# EAGLE design 24dc_cup_wash_sucction (EAGLE 8.5.1)

## Sheet 1 of 3
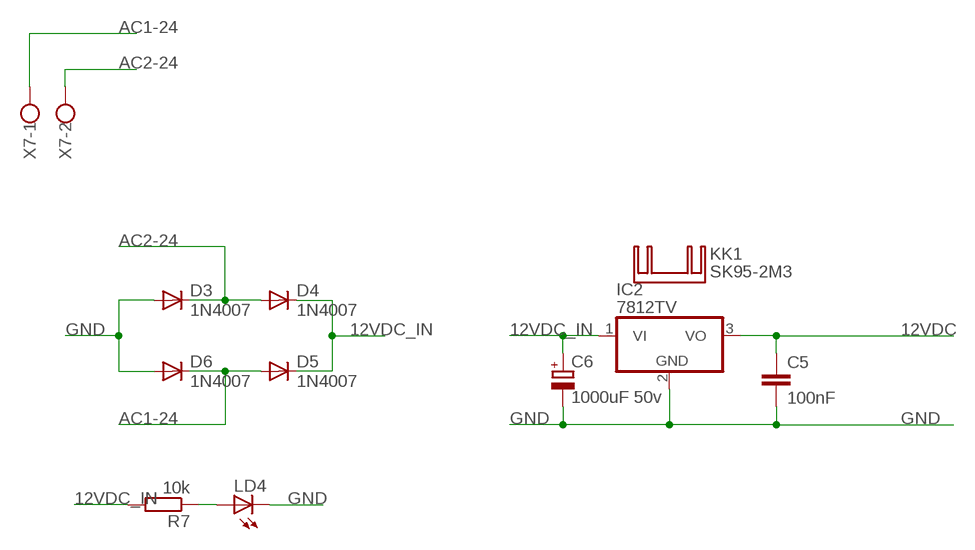
[diagram p0: schematic, sheet 1]

### Parts
C5  100nF  C-EU050-025X075  [C050-025X075]
C6  1000uF 50v  CPOL-EUE5-13  [E5-13]
D3  1N4007  1N4004  [DO41-10]
D4  1N4007  1N4004  [DO41-10]
D5  1N4007  1N4004  [DO41-10]
D6  1N4007  1N4004  [DO41-10]
IC2  7812TV  [TO220V]
KK1  SK95-2M3  [SK95-2M3]
LD4  LED5MM  [LED5MM]
R7  10k  R-EU_0207/10  [0207/10]
X7  W237-102  [W237-102]

### Nets
12VDC: C5.1 IC2.3(VO) ; also sheet 2
12VDC_IN: C6.+ D4.C D5.C IC2.1(VI) R7.2 ; also sheet 2,3
AC1-24: D5.A D6.C X7.1
AC2-24: D3.C D4.A X7.2
GND: C5.2 C6.- D3.A D6.A IC2.2(GND) LD4.K(C) ; also sheet 2,3
N$8: LD4.A R7.1

## Sheet 2 of 3
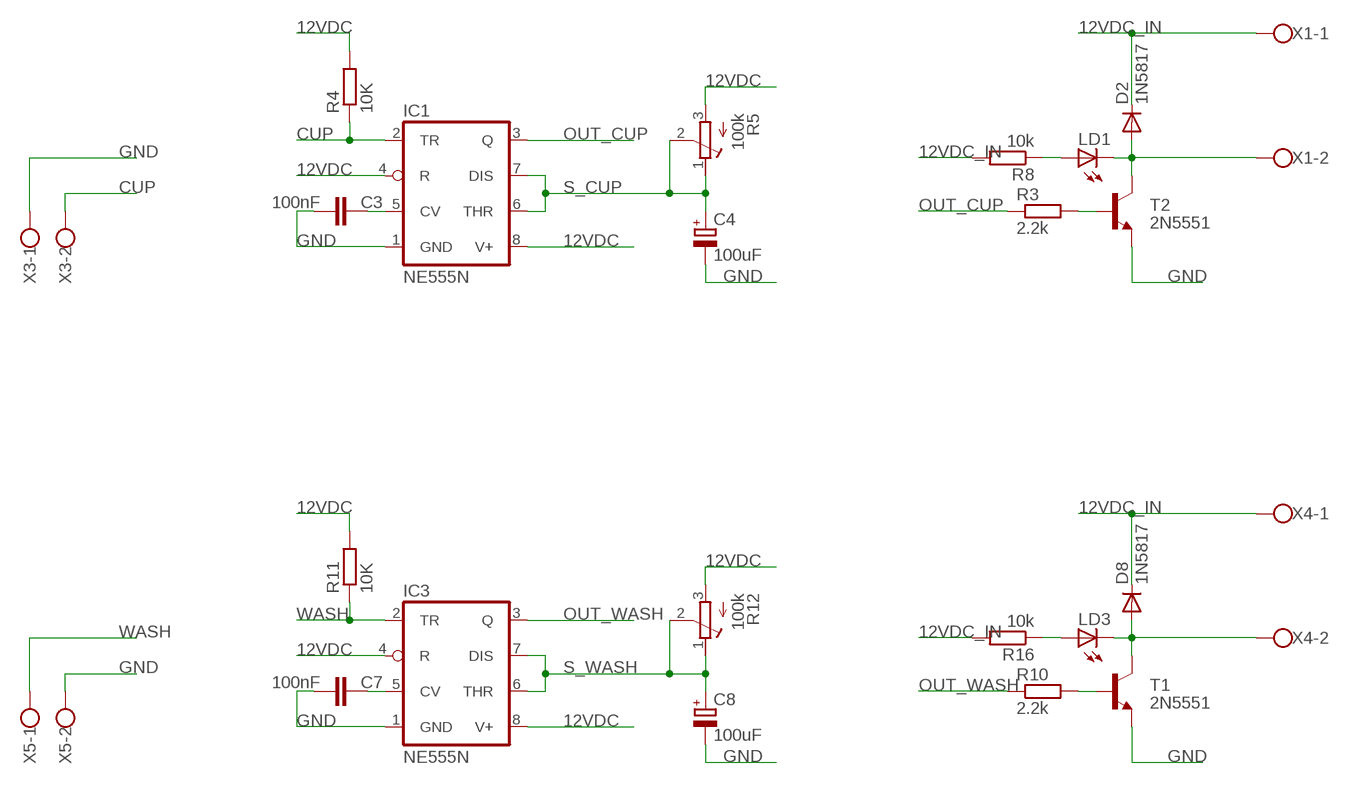
[diagram p1: schematic, sheet 2]

### Parts
C3  100nF  C-EU050-025X075  [C050-025X075]
C4  100uF  CPOL-EUE3.5-8  [E3,5-8]
C7  100nF  C-EU050-025X075  [C050-025X075]
C8  100uF  CPOL-EUE3.5-8  [E3,5-8]
D2  1N5817  1N4004  [DO41-10]
D8  1N5817  1N4004  [DO41-10]
IC1  NE555N  [DIL08-ROUND]
IC3  NE555N  [DIL08-ROUND]
LD1  LED5MM  [LED5MM]
LD3  LED5MM  [LED5MM]
R3  2.2k  R-EU_0207/10  [0207/10]
R4  10K  R-EU_0207/10  [0207/10]
R5  100k  R-TRIMMT93XA  [RTRIMT93XA]
R8  10k  R-EU_0207/10  [0207/10]
R10  2.2k  R-EU_0207/10  [0207/10]
R11  10K  R-EU_0207/10  [0207/10]
R12  100k  R-TRIMMT93XA  [RTRIMT93XA]
R16  10k  R-EU_0207/10  [0207/10]
T1  2N5551  2N2222  [TO92-EBC-OVAL]
T2  2N5551  2N2222  [TO92-EBC-OVAL]
X1  W237-102  [W237-102]
X3  W237-102  [W237-102]
X4  W237-102  [W237-102]
X5  W237-102  [W237-102]

### Nets
12VDC: IC1.4(R) IC1.8(V+) IC3.4(R) IC3.8(V+) R4.2 R5.3(A) R11.2 R12.3(A) ; also sheet 1
12VDC_IN: D2.C D8.C R8.2 R16.2 X1.1 X4.1 ; also sheet 1,3
CUP: IC1.2(TR) R4.1 X3.2
GND: C3.2 C4.- C7.2 C8.- IC1.1(GND) IC3.1(GND) T1.E T2.E X3.1 X5.2 ; also sheet 1,3
N$1: R3.2 T2.B
N$2: C3.1 IC1.5(CV)
N$3: D2.A LD1.K(C) T2.C X1.2
N$5: C7.1 IC3.5(CV)
N$6: LD1.A R8.1
N$11: D8.A LD3.K(C) T1.C X4.2
N$12: R10.2 T1.B
N$14: LD3.A R16.1
OUT_CUP: IC1.3(Q) R3.1
OUT_WASH: IC3.3(Q) R10.1
S_CUP: C4.+ IC1.6(THR) IC1.7(DIS) R5.1(E) R5.2(S)
S_WASH: C8.+ IC3.6(THR) IC3.7(DIS) R12.1(E) R12.2(S)
WASH: IC3.2(TR) R11.1 X5.1

## Sheet 3 of 3
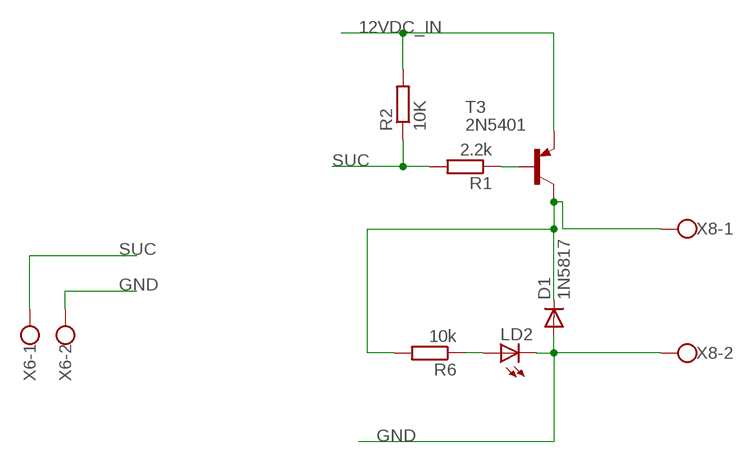
[diagram p2: schematic, sheet 3]

### Parts
D1  1N5817  1N4004  [DO41-10]
LD2  LED5MM  [LED5MM]
R1  2.2k  R-EU_0207/10  [0207/10]
R2  10K  R-EU_0207/10  [0207/10]
R6  10k  R-EU_0207/10  [0207/10]
T3  2N5401  2N5401-PNP-TO92-EBC  [TO92-EBC]
X6  W237-102  [W237-102]
X8  W237-102  [W237-102]

### Nets
12VDC_IN: R2.2 T3.E ; also sheet 1,2
GND: D1.A LD2.K(C) X6.2 X8.2 ; also sheet 1,2
N$7: R1.1 T3.B
N$9: LD2.A R6.1
NS1: D1.C R6.2 T3.C X8.1
SUC: R1.2 R2.1 X6.1

## Library data of the parts
C3 C5 C7 = rcl:C-EU: CAPACITOR, European symbol; SPICEPREFIX: C
C4 C6 C8 = rcl:CPOL-EU: POLARIZED CAPACITOR, European symbol; SPICEPREFIX: C
D1-D6 D8 = adafruit:1N4004: DIODE General purpose 1N400x type rectifier (With bigger pads) http://www.ladyada.net/library/pcb/eaglelibrary.html
IC1 IC3 = adafruit:*555: TIMER Changed DIP package to have round (not oval) pin pads http://www.ladyada.net/library/pcb/eaglelibrary.html
IC2 = linear:78*: Positive VOLTAGE REGULATOR Source: http://cache.national.com/ds/LM/LM78L05.pdf http://www.fairchildsemi.com/ds/LM/LM7805.pdf
KK1 = heatsink:SK95-2M3: HEATSINK manufacturer Fischer/distributor Buerklin
LD1-LD4 = led:LED: LED OSRAM: - CHIPLED LG R971, LG N971, LY N971, LG Q971, LY Q971, LO R971, LY R971 LH N974, LH R974 LS Q976, LO Q976, LY Q976 LO Q996 - Hyper CHIPLED LW Q18S LB Q993, LB Q99A, LB R99A - SideLED LS A670, LO A670, LY A670, LG A670, LP A670 LB A673, LV A673, LT A673, LW A673 LH A674 LY A675 LS A676, LA A676, LO A676, LY A676, LW A676 LS A679, LY A679, LG A679 - Hyper Micro SIDELED® LS Y876, LA Y876, LO Y876, LY Y876 LT Y87S - SmartLED LW L88C, LW L88S LB L89C, LB L89S, LG L890 LS L89K, LO L89K, LY L89K LS L896, LA L896, LO L896, LY L896 - TOPLED LS T670, LO T670, LY T670, LG T670, LP T670 LSG T670, LSP T670, LSY T670, LOP T670, LYG T670 LG T671, LOG T671, LSG T671 LB T673, LV T673, LT T673, LW T673 LH T674 LS T676, LA T676, LO T676, LY T676, LB T676, LH T676, LSB T676, LW T676 LB T67C, LV T67C, LT T67C, LS T67K, LO T67K, LY T67K, LW E67C LS E67B, LA E67B, LO E67B, LY E67B, LB E67C, LV E67C, LT E67C LW T67C LS T679, LY T679, LG T679 LS T770, LO T770, LY T770, LG T770, LP T770 LB T773, LV T773, LT T773, LW T773 LH T774 LS E675, LA E675, LY E675, LS T675 LS T776, LA T776, LO T776, LY T776, LB T776 LHGB T686 LT T68C, LB T68C - Hyper Mini TOPLED® LB M676 - Mini TOPLED Santana® LG M470 LS M47K, LO M47K, LY M47K Source: http://www.osram.convergy.de/
R1-R4 R6-R8 R10 R11 R16 = rcl-2:R-EU_: RESISTOR, European symbol
R5 R12 = rcl:R-TRIMM: Trimm resistor; SPICEMODEL: X; SPICEPREFIXL: POT
T1 T2 = adafruit:2N2222: NPN TRANSISTOR Big oval pads
T3 = transistor-neu-to92:*-PNP-: PNP Transistror
X1 X3-X8 = con-wago-500:W237-102: WAGO SCREW CLAMP

## Board
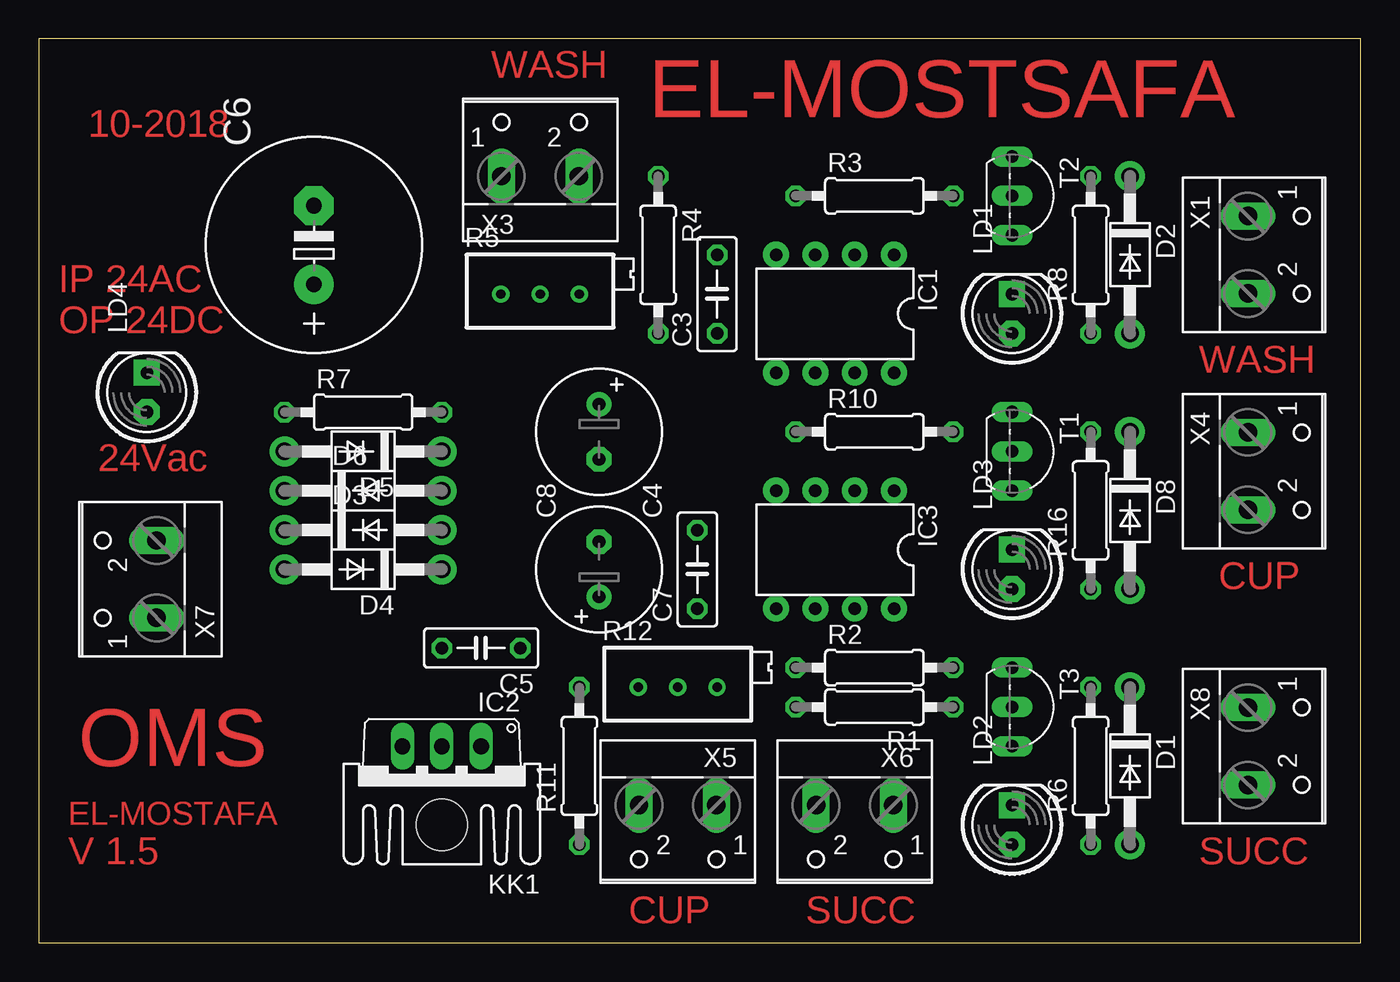
[diagram p3: board, top side]
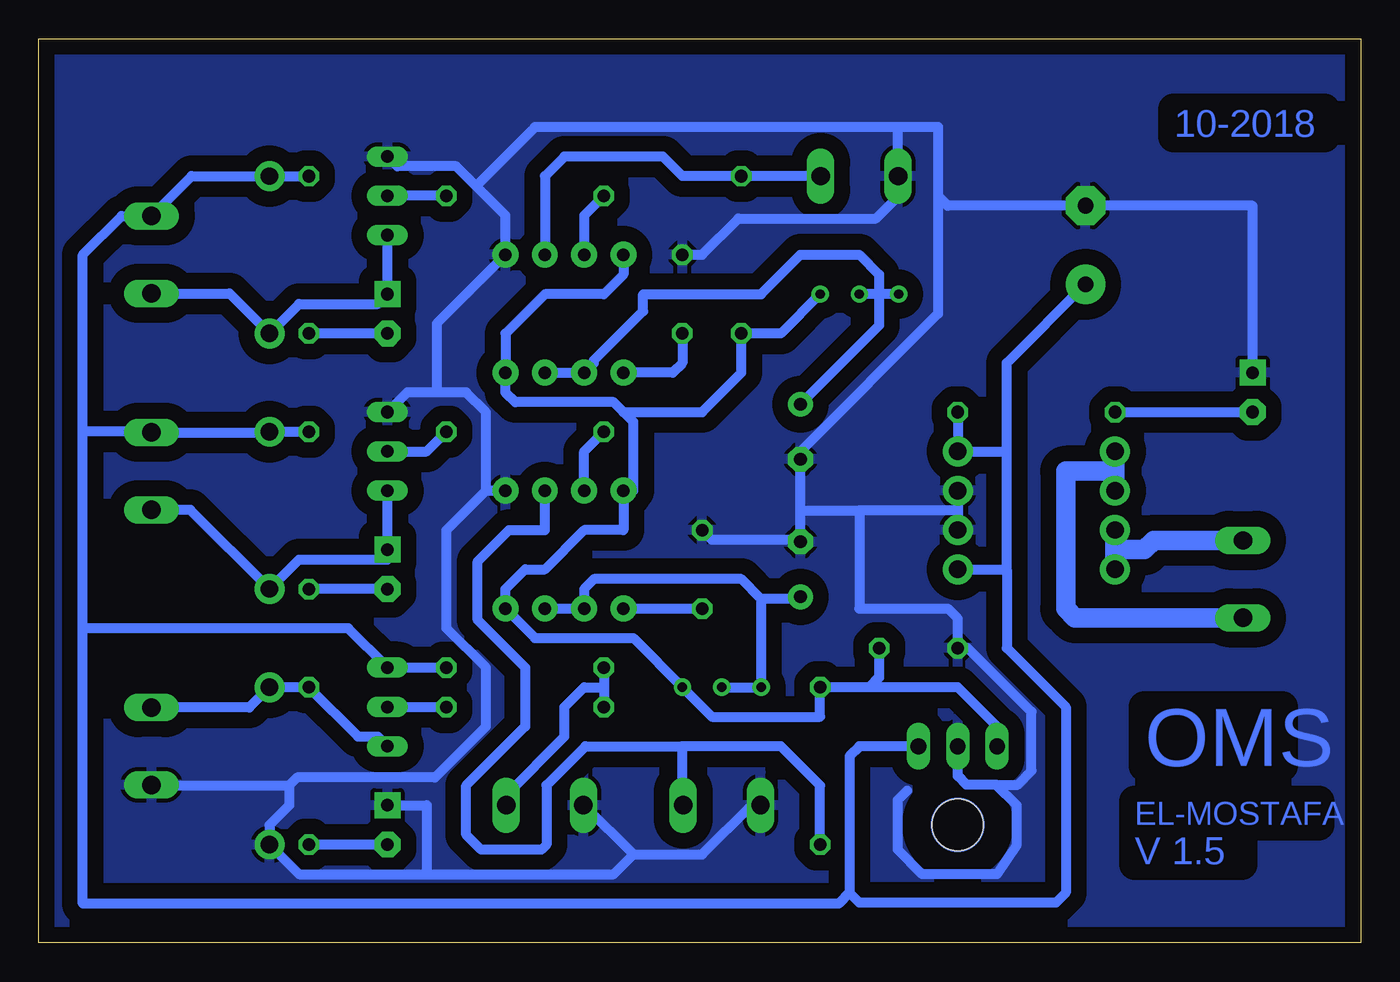
[diagram p4: board, bottom side, seen from below]

Size 85.39 x 58.41 mm. Coordinates in mm from the lower left corner, seen from the top.
Outline: 0,0 85.39,0 85.39,58.41 0,58.41 0,0
Copper layers (1*16): Top 0.035mm / dielectric 1.5mm / Bottom 0.035mm
Design rules "default *": minimum track width 25mil, minimum drill 0.35mm, track to track 40mil, track to pad 40mil, pad to pad 6mil, via to via 6mil, smd to smd 6mil, copper to edge 40mil, drill to drill 6mil, minimum pad ring 10mil, minimum via ring 8mil, stop-mask expansion 4mil, vias tented up to drill 0mil, thermal gap 10mil

### Footprints (pad centres in the part's own frame; a part is rotated, then mirrored left to right if it is on the bottom)
C050-025X075 = drill 0.813 octagon: 1 -2.54,0; 2 2.54,0
E3,5-8 = drill 0.813 pad 1.6: + -1.778,0 | drill 0.813 pad 1.6 octagon: - 1.778,0
E5-13 = drill 1.016 pad 2.54: + -2.54,0 | drill 1.016 pad 2.54 octagon: - 2.54,0
DO41-10 = drill 1.118 pad 1.93: A 5.08,0; C -5.08,0
DIL08-ROUND = drill 0.813 pad 1.676: 1 -3.81,-3.81; 2 -1.27,-3.81; 3 1.27,-3.81; 4 3.81,-3.81; 5 3.81,3.81; 6 1.27,3.81; 7 -1.27,3.81; 8 -3.81,3.81
TO220V = drill 1.016 long: 1 -2.54,-2.54; 2 0,-2.54; 3 2.54,-2.54
SK95-2M3 = hole 3.302: 0,2.54
LED5MM = drill 0.813 pad 1.676 octagon: A -1.27,0 | drill 0.813 pad 1.676 square: K 1.27,0
0207/10 = drill 0.813 octagon: 1 -5.08,0; 2 5.08,0
RTRIMT93XA = drill 0.61: 1 0,-2.54; 2 0,0; 3 0,2.54
TO92-EBC-OVAL = drill 0.813 long: B 0,-1.27; C 2.54,-1.27; E -2.54,-1.27
TO92-EBC = drill 0.813 long: B 0,-1.27; C 2.54,-1.27; E -2.54,-1.27
W237-102 = drill 1.194 long: 1 -2.5,-1.27; 2 2.5,-1.27

### Placement (x,y rotation side)
C3  43.81,41.91 90 top
C4  36.2,33.02 270 top
C5  28.57,19.05 180 top
C6  17.78,45.09 90 top
C7  42.55,24.13 90 top
C8  36.2,24.13 90 top
D1  70.48,11.43 270 top
D2  70.48,44.45 270 top
D3  20.95,26.67 0 top
D4  20.95,24.13 180 top
D5  20.95,31.75 180 top
D6  20.95,29.21 0 top
D8  70.48,27.94 270 top
IC1  51.44,40.64 180 top
IC2  26.04,10.16 180 top
IC3  51.44,25.4 180 top
KK1  26.04,10.16 180 top
LD1  62.87,40.64 90 top
LD2  62.87,7.62 90 top
LD3  62.87,24.13 90 top
LD4  6.99,35.56 90 top
R1  53.98,15.24 180 top
R2  53.98,17.78 0 top
R3  53.98,48.26 0 top
R4  40.01,44.45 270 top
R5  32.38,41.91 270 top
R6  67.94,11.43 90 top
R7  20.95,34.29 0 top
R8  67.94,44.45 90 top
R10  53.98,33.02 0 top
R11  34.92,11.43 90 top
R12  41.27,16.51 270 top
R16  67.94,27.94 90 top
T1  64.14,31.75 270 top
T2  64.14,48.26 270 top
T3  64.14,15.24 270 top
X1  79.38,44.45 270 top
X3  32.38,50.8 0 top
X4  79.38,30.48 270 top
X5  41.27,7.62 180 top
X6  52.7,7.62 180 top
X7  6.35,23.5 90 top
X8  79.38,12.7 270 top

### Tracks (layer width: path | path; a pad name or v marks a point on that pad's centre or on a via)
12VDC
  Bottom 0.635: 47.62,34.29 46.99,33.66 46.99,29.21 IC3.4 47.62,26.67 50.16,26.67 52.7,24.13 53.98,24.13 55.24,22.86 IC3.8 53.34,19.68 46.99,19.68 R12.3 41.91,14.61 34.92,14.61 R11.2 31.75,16.51 | 47.62,34.29 48.26,34.93 54.61,34.93 55.24,35.56 IC1.8 55.24,39.37 52.7,41.91 48.9,41.91 47.62,43.18 IC1.4 | IC2.3 23.5,13.97 26.04,16.51 31.75,16.51 | R5.3 37.47,39.37 R4.2 40.01,36.83 42.55,34.29 47.62,34.29 | C5.1 31.11,17.14 31.75,16.51
12VDC_IN
  Bottom 0.635: R8.2 D2.C 75.53,49.53 X1.1 80.05,46.95 82.55,44.45 82.55,33.02 | R2.2 T3.E 65.41,20.32 82.55,20.32 | R16.2 D8.C 70.53,32.98 X4.1 78.06,33.02 | 33.02,3.24 33.02,12.06 32.38,12.7 IC2.1 | 33.02,3.24 32.38,2.6 19.68,2.6 19.05,3.24 19.05,15.24 22.86,19.05 22.86,24.13 | 33.02,3.24 33.72,2.54 82.55,2.54 82.55,20.32 | 22.86,31.75 D5.C R7.2 | 22.86,24.13 22.86,31.75 | D4.C 22.86,24.13 | 22.86,31.75 22.86,37.47 C6.+ | 82.55,20.32 82.55,33.02 | 78.06,33.02 77.47,33.02 | 78.06,33.02 82.55,33.02
AC1-24
  Bottom 0.635: D6.C 15.88,30.48 D5.A
  Bottom 1.27: X7.1 18.45,21 19.05,21.59 19.05,30.48 15.88,30.48 | D6.C D5.A
AC2-24
  Bottom 0.635: D3.C 15.88,26.59 15.88,25.4 D4.A
  Bottom 1.27: X7.2 13.38,26 13.97,25.4 15.88,25.4 | D4.A 15.88,26.59
CUP
  Bottom 0.635: IC1.2 52.7,49.53 51.44,50.8 45.09,50.8 43.81,49.53 R4.1 X3.2
GND
  Bottom 0.635: 46.99,5.71 42.55,5.71 39.37,8.89 X5.2 | 46.99,5.71 50.16,8.89 X6.2 | T2.E 62.23,50.17 58.42,50.17 57.15,48.9 | 57.15,48.9 55.24,46.99 IC1.1 59.69,40.01 59.69,35.56 | C7.2 41.91,26.04 36.2,26.04 | 36.2,26.04 36.2,27.94 | 36.2,27.94 C4.- 36.2,31.75 27.3,40.64 27.3,48.26 | 36.2,26.04 C8.- | 36.2,27.94 32.38,27.94 | 57.15,48.9 53.34,52.71 29.84,52.71 | 29.84,52.71 27.3,52.71 27.3,48.26 | 32.38,27.94 32.38,21.59 26.67,21.59 26.04,20.95 C5.2 25.4,19.05 21.27,14.92 21.27,11.11 22.16,10.22 23.56,10.22 | 29.84,52.71 29.89,52.67 X3.1 29.89,48.3 29.84,48.26 31.32,46.79 40.21,46.79 42.55,44.45 C3.2 | 56.52,29.21 59.05,26.67 59.05,20.32 56.52,17.78 56.52,13.97 59.8,10.68 68.69,10.68 69.22,10.16 | 56.52,29.21 IC3.1 | 69.22,10.16 69.22,8.89 70.48,7.62 D1.A 68.58,4.45 60.33,4.45 | 46.99,5.71 48.26,4.45 60.33,4.45 | LD2.K 60.33,8.89 60.33,4.45 | 56.52,29.21 56.52,34.29 57.78,35.56 59.69,35.56 | D6.A 26.04,27.94 | 26.04,27.94 D3.A | 26.04,27.94 32.38,27.94 | X8.2 78.06,10.16 69.22,10.16 | LD4.K 6.99,47.62 C6.- 26.67,47.62 27.3,48.26 | 59.69,35.56 61.59,35.56 T1.E | 29.29,9.84 29.91,9.22 29.91,6.02 28.34,4.45 23.5,4.45 22.23,6.35 22.23,8.89 23.56,10.22 | 23.56,10.22 25.48,10.22 26.04,10.78 IC2.2
  pour Bottom: 0,58.42 85.09,58.42 85.09,0 0,0
N$1
  Bottom 0.635: R3.2 T2.B
N$2
  Bottom 0.635: C3.1 43.81,37.47 44.45,36.83 IC1.5
N$3
  Bottom 0.635: T2.C LD1.K 63.5,41.28 68.58,41.28 D2.A 73.06,41.95 X1.2
N$5
  Bottom 0.635: IC3.5 C7.1
N$6
  Bottom 0.635: LD1.A R8.1
N$7
  Bottom 0.635: T3.B R1.1
N$8
  Bottom 0.635: R7.1 LD4.A
N$9
  Bottom 0.635: LD2.A R6.1
N$11
  Bottom 0.635: T1.C LD3.K 62.87,24.77 68.58,24.77 D8.A 75.61,27.98 X4.2
N$12
  Bottom 0.635: R10.2 60.33,31.75 T1.B
N$14
  Bottom 0.635: LD3.A R16.1
NS1
  Bottom 0.635: T3.C 63.5,13.33 64.77,13.33 R6.2 D1.C 71.8,15.2 X8.1
OUT_CUP
  Bottom 0.635: R3.1 50.16,46.99 IC1.3
OUT_WASH
  Bottom 0.635: IC3.3 50.16,31.75 R10.1
S_CUP
  Bottom 0.635: IC1.7 IC1.6 49.54,37.45 49.54,37.62 46.35,40.81 46.35,41.91 38.73,41.91 36.2,44.45 32.38,44.45 31.11,43.18 31.11,41.91 | 31.11,41.91 R5.2 | R5.1 31.11,41.91 | 31.11,41.91 31.11,39.88 C4.+
S_WASH
  Bottom 0.635: IC3.7 IC3.6 50.16,22.86 49.53,23.5 40.01,23.5 38.73,22.22 | R12.2 R12.1 38.73,22.22 | 38.73,22.22 36.2,22.22 C8.+
SUC
  Bottom 0.635: R2.1 48.9,16.51 | 48.9,16.51 R1.2 | 48.9,16.51 50.16,16.51 51.44,15.24 51.44,13.32 55.24,9.51 55.24,8.89 X6.1
WASH
  Bottom 0.635: R11.1 34.92,10.16 37.47,12.7 43.81,12.7 | 43.77,10.2 X5.1 43.81,8.93 43.81,12.7 | IC3.2 52.7,26.67 55.02,26.67 57.04,24.65 57.04,20.85 56.52,20.33 56.52,20.32 53.98,17.78 53.98,13.97 57.78,10.16 57.78,6.98 56.82,6.02 52.93,6.02 52.6,6.35 52.6,10.19 50.08,12.7 43.81,12.7
(copper drawn outside any net)
  shapes: Bottom circle x1

### Text on the board
Top: WASH | EL-MOSTSAFA | 10-2018 | IP 24AC / OP 24DC | WASH | 24Vac | CUP | OMS | EL-MOSTAFA | V 1.5 | SUCC | CUP | SUCC
Bottom: 10-2018 | OMS | EL-MOSTAFA | V 1.5